# Altium schematic sheet 4.SchDoc
size 420 x 297 mm
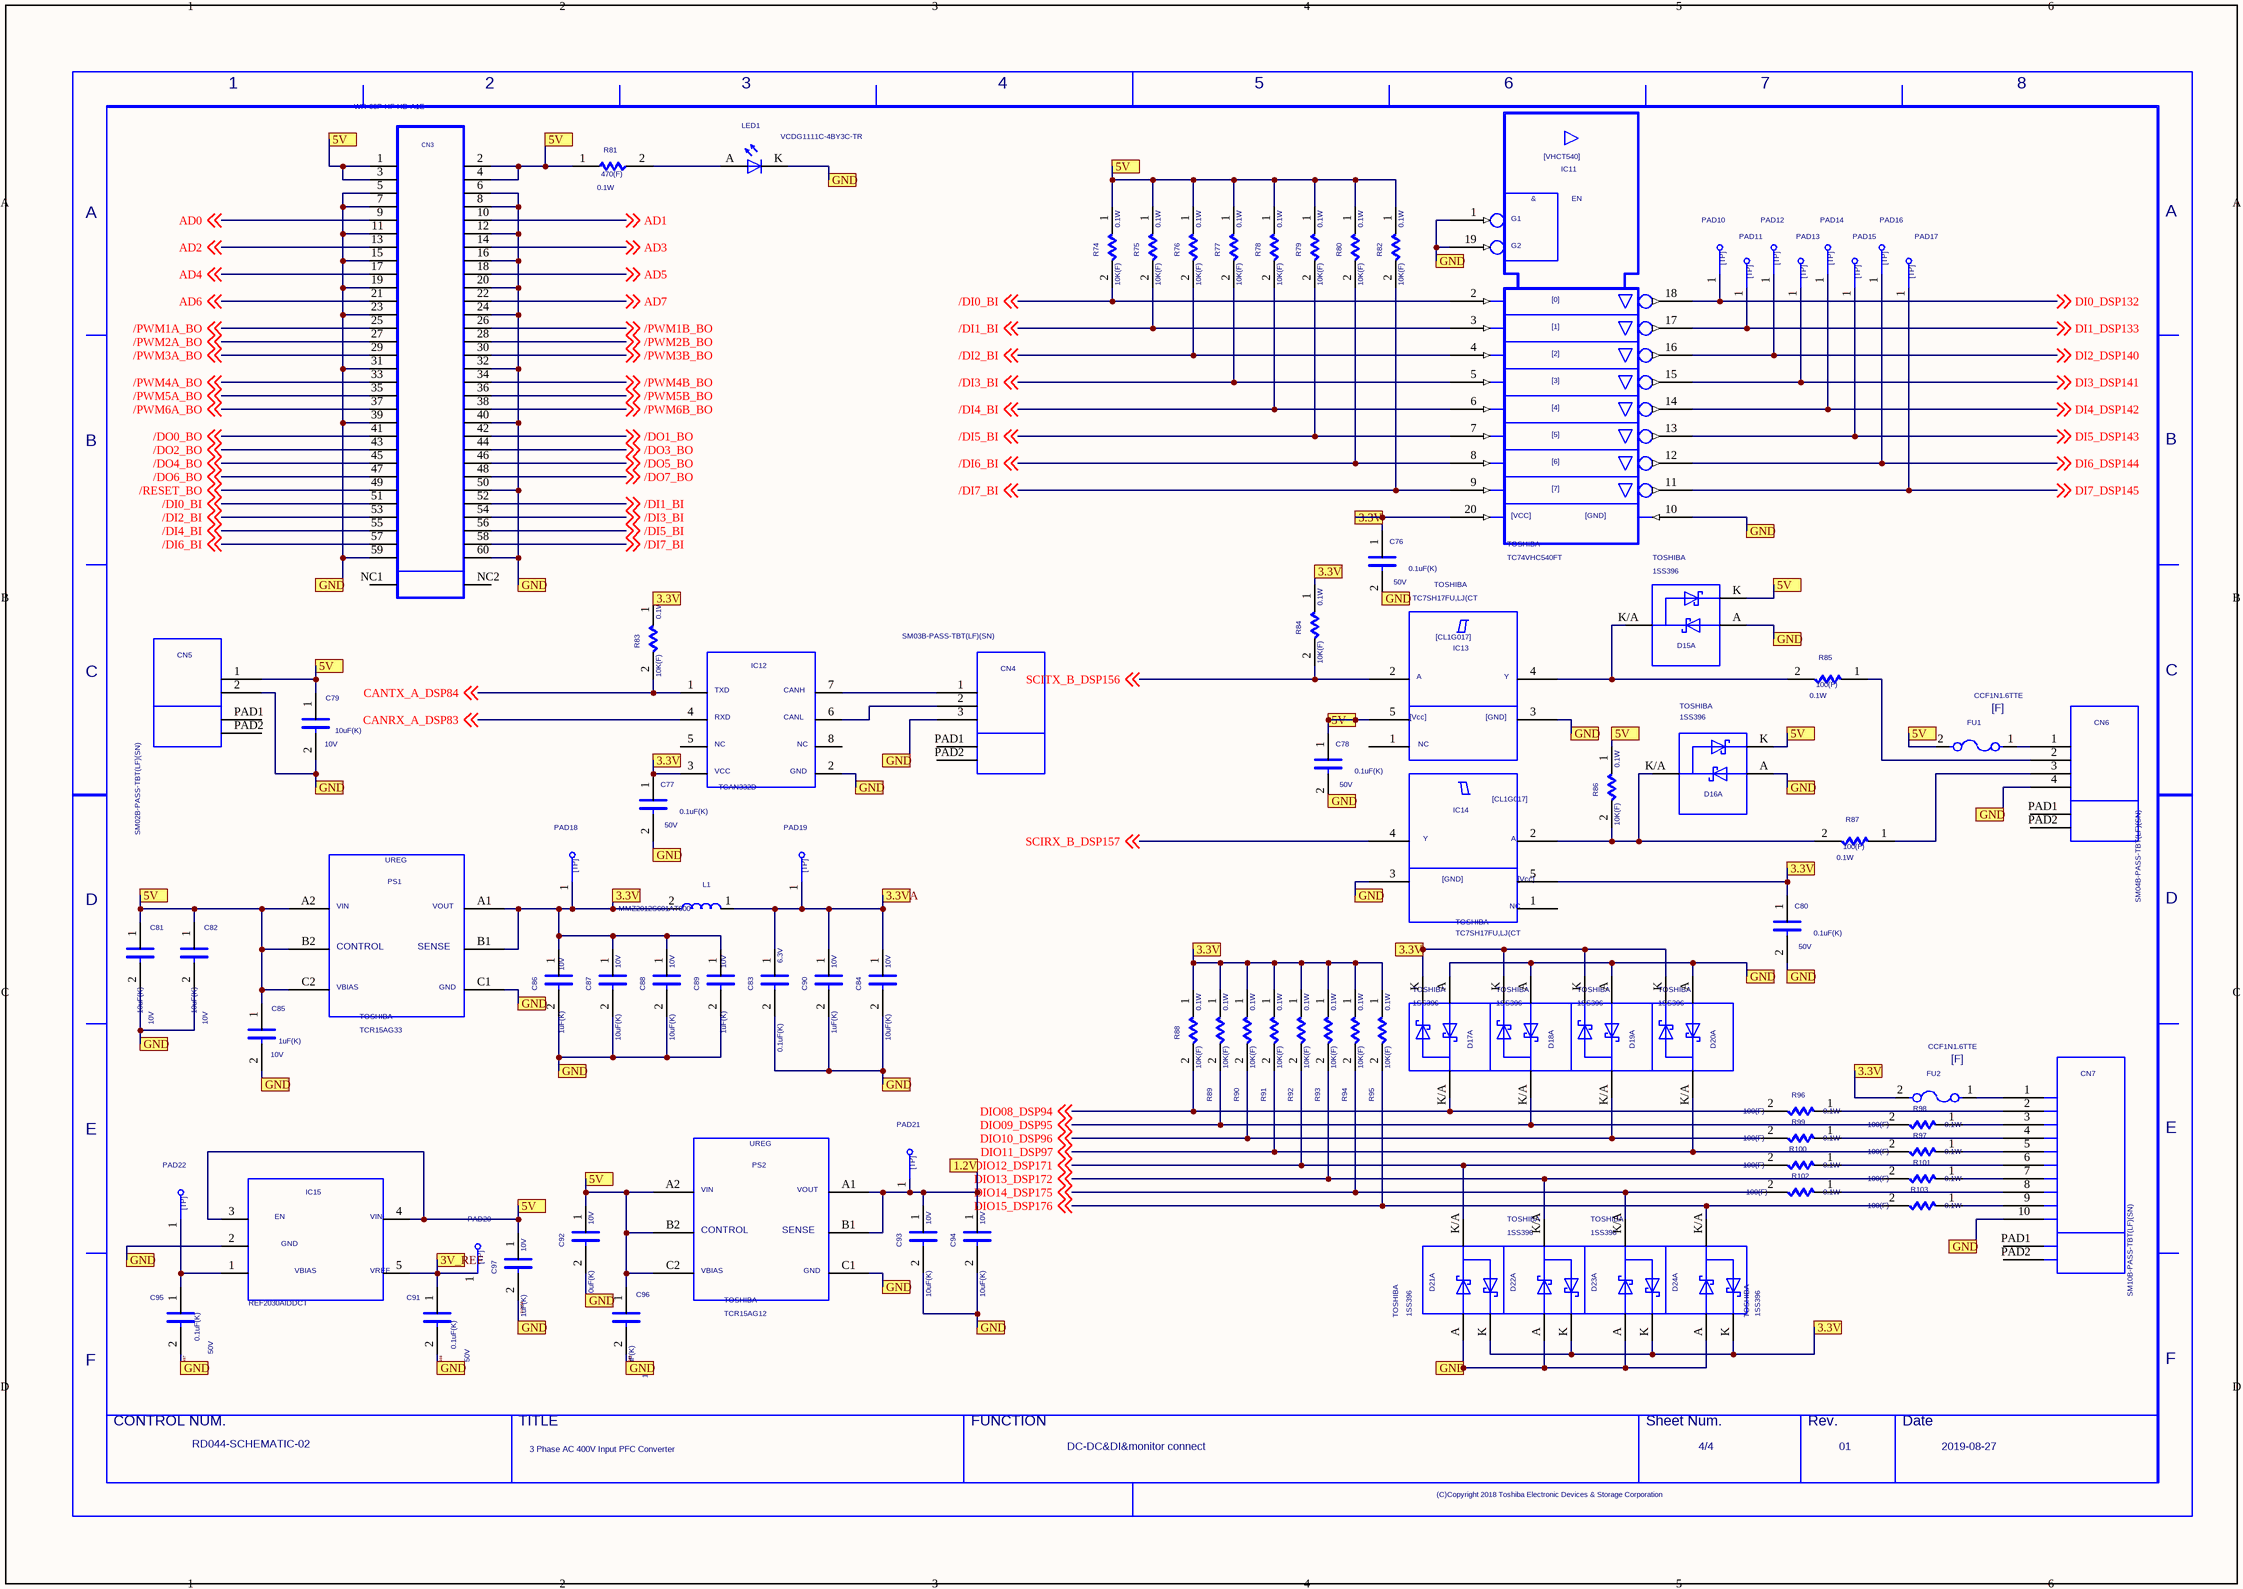
[diagram p0: 4.SchDoc]

## Parts
C76  VAL2: 50V  VAL1: 0.1uF(K)  (hidden comment: C)
C77  VAL2: 50V  VAL1: 0.1uF(K)  (hidden comment: C)
C78  VAL2: 50V  VAL1: 0.1uF(K)  (hidden comment: C)
C79  VAL2: 10V  VAL1: 10uF(K)  (hidden comment: C)
C80  VAL2: 50V  VAL1: 0.1uF(K)  (hidden comment: C)
C81  VAL2: 10V  VAL1: 10uF(K)  (hidden comment: C)
C82  VAL2: 10V  VAL1: 10uF(K)  (hidden comment: C)
C83  VAL2: 6.3V  VAL1: 0.1uF(K)  (hidden comment: C)
C84  VAL2: 10V  VAL1: 10uF(K)  (hidden comment: C)
C85  VAL2: 10V  VAL1: 1uF(K)  (hidden comment: C)
C86  VAL2: 10V  VAL1: 1uF(K)  (hidden comment: C)
C87  VAL2: 10V  VAL1: 10uF(K)  (hidden comment: C)
C88  VAL2: 10V  VAL1: 10uF(K)  (hidden comment: C)
C89  VAL2: 10V  VAL1: 1uF(K)  (hidden comment: C)
C90  VAL2: 10V  VAL1: 1uF(K)  (hidden comment: C)
C91  VAL2: 50V  VAL1: 0.1uF(K)  (hidden comment: C)
C92  VAL2: 10V  VAL1: 10uF(K)  (hidden comment: C)
C93  VAL2: 10V  VAL1: 10uF(K)  (hidden comment: C)
C94  VAL2: 10V  VAL1: 10uF(K)  (hidden comment: C)
C95  VAL2: 50V  VAL1: 0.1uF(K)  (hidden comment: C)
C96  VAL2: 10V  VAL1: 1uF(K)  (hidden comment: C)
C97  VAL2: 10V  VAL1: 1uF(K)  (hidden comment: C)
CN3  VAL3: WR-60P-HF-HD-A1E  (hidden comment: WR-60P)
CN4  VAL3: SM03B-PASS-TBT(LF)(SN)  (hidden comment: BM03B-PASS)
CN5  VAL3: SM02B-PASS-TBT(LF)(SN)  (hidden comment: BM02B-PASS)
CN6  VAL3: SM04B-PASS-TBT(LF)(SN)  (hidden comment: BM04B-PASS)
CN7  VAL3: SM10B-PASS-TBT(LF)(SN)  (hidden comment: SM10B-PASS)
D15  USERCOMPTEXT3: TOSHIBA  (hidden comment: 1SS396)  (part A of 3)
D16  USERCOMPTEXT3: TOSHIBA  (hidden comment: 1SS396)  (part A of 3)
D17  USERCOMPTEXT3: TOSHIBA  (hidden comment: 1SS396)  (part A of 3)
D18  USERCOMPTEXT3: TOSHIBA  (hidden comment: 1SS396)  (part A of 3)
D19  USERCOMPTEXT3: TOSHIBA  (hidden comment: 1SS396)  (part A of 3)
D20  USERCOMPTEXT3: TOSHIBA  (hidden comment: 1SS396)  (part A of 3)
D21  USERCOMPTEXT3: TOSHIBA  (hidden comment: 1SS396)  (part A of 3)
D22  USERCOMPTEXT3: TOSHIBA  (hidden comment: 1SS396)  (part A of 3)
D23  USERCOMPTEXT3: TOSHIBA  (hidden comment: 1SS396)  (part A of 3)
D24  USERCOMPTEXT3: TOSHIBA  (hidden comment: 1SS396)  (part A of 3)
FU1  VAL3: CCF1N1.6TTE  (hidden comment: F)
FU2  VAL3: CCF1N1.6TTE  (hidden comment: F)
IC11  USERCOMPTEXT3: TOSHIBA  VAL3: TC74VHC540FT  (hidden comment: VHC540)
IC12  TCAN332D
IC13  USERCOMPTEXT3: TOSHIBA  VAL3: TC7SH17FU,LJ(CT  (hidden comment: CL1G017)
IC14  USERCOMPTEXT3: TOSHIBA  VAL3: TC7SH17FU,LJ(CT  (hidden comment: CL1G017)
IC15  VAL3: REF2030AIDDCT  (hidden comment: REF)
L1  VAL3: MMZ2012S601AT000  (hidden comment: L)
LED1  VAL3: VCDG1111C-4BY3C-TR  (hidden comment: VCDG1111C)
PAD10  TP  (value not drawn)
PAD11  TP  (value not drawn)
PAD12  TP  (value not drawn)
PAD13  TP  (value not drawn)
PAD14  TP  (value not drawn)
PAD15  TP  (value not drawn)
PAD16  TP  (value not drawn)
PAD17  TP  (value not drawn)
PAD18  TP  (value not drawn)
PAD19  TP  (value not drawn)
PAD20  TP  (value not drawn)
PAD21  TP  (value not drawn)
PAD22  TP  (value not drawn)
PS1  USERCOMPTEXT3: TOSHIBA  VAL3: TCR15AG33  (hidden comment: L15AG)
PS2  USERCOMPTEXT3: TOSHIBA  VAL3: TCR15AG12  (hidden comment: L15AG)
R74  VAL2: 0.1W  VAL1: 10K(F)  (hidden comment: R)
R75  VAL2: 0.1W  VAL1: 10K(F)  (hidden comment: R)
R76  VAL2: 0.1W  VAL1: 10K(F)  (hidden comment: R)
R77  VAL2: 0.1W  VAL1: 10K(F)  (hidden comment: R)
R78  VAL2: 0.1W  VAL1: 10K(F)  (hidden comment: R)
R79  VAL2: 0.1W  VAL1: 10K(F)  (hidden comment: R)
R80  VAL2: 0.1W  VAL1: 10K(F)  (hidden comment: R)
R81  VAL2: 0.1W  VAL1: 470(F)  (hidden comment: R)
R82  VAL2: 0.1W  VAL1: 10K(F)  (hidden comment: R)
R83  VAL2: 0.1W  VAL1: 10K(F)  (hidden comment: R)
R84  VAL2: 0.1W  VAL1: 10K(F)  (hidden comment: R)
R85  VAL2: 0.1W  VAL1: 100(F)  (hidden comment: R)
R86  VAL2: 0.1W  VAL1: 10K(F)  (hidden comment: R)
R87  VAL2: 0.1W  VAL1: 100(F)  (hidden comment: R)
R88  VAL2: 0.1W  VAL1: 10K(F)  (hidden comment: R)
R89  VAL2: 0.1W  VAL1: 10K(F)  (hidden comment: R)
R90  VAL2: 0.1W  VAL1: 10K(F)  (hidden comment: R)
R91  VAL2: 0.1W  VAL1: 10K(F)  (hidden comment: R)
R92  VAL2: 0.1W  VAL1: 10K(F)  (hidden comment: R)
R93  VAL2: 0.1W  VAL1: 10K(F)  (hidden comment: R)
R94  VAL2: 0.1W  VAL1: 10K(F)  (hidden comment: R)
R95  VAL2: 0.1W  VAL1: 10K(F)  (hidden comment: R)
R96  VAL2: 0.1W  VAL1: 100(F)  (hidden comment: R)
R97  VAL2: 0.1W  VAL1: 100(F)  (hidden comment: R)
R98  VAL2: 0.1W  VAL1: 100(F)  (hidden comment: R)
R99  VAL2: 0.1W  VAL1: 100(F)  (hidden comment: R)
R100  VAL2: 0.1W  VAL1: 100(F)  (hidden comment: R)
R101  VAL2: 0.1W  VAL1: 100(F)  (hidden comment: R)
R102  VAL2: 0.1W  VAL1: 100(F)  (hidden comment: R)
R103  VAL2: 0.1W  VAL1: 100(F)  (hidden comment: R)
U?  DATE: 2019-08-27  REVISION: 01  SHEETNUMBER: 4/4  FUNCTION: DC-DC&DI&monitor connect  TITLE: 3 Phase AC 400V Input PFC Converter  DRAWINGNUMBER: RD044-SCHEMATIC-02  (hidden comment: WAKU_DEF100_2018)

## Ports
1.2V, 3.3V, 3.3VA, 3V_REF, 5V, GND

## Nets
1.2V: C93.1 C94.1 PAD21.1 PS2.A1 PS2.B1 ; port 1.2V
3.3V: C76.1 C77.1 C80.1 C86.1 C87.1 C88.1 C89.1 D17.K D18.K D19.K D20.K D21.K D22.K D23.K D24.K FU2.2 IC11.20 IC12.3 IC14.5 L1.2 PAD18.1 PS1.A1 PS1.B1 R83.1 R84.1 R88.1 R89.1 R90.1 R91.1 R92.1 R93.1 R94.1 R95.1 ; port 3.3V
3.3VA: C83.1 C84.1 C90.1 L1.1 PAD19.1 ; port 3.3VA
3V_REF: C91.1 IC15.5 PAD20.1 ; port 3V_REF
5V: C78.1 C79.1 C81.1 C82.1 C85.1 C92.1 C96.1 C97.1 CN3.1 CN3.2 CN3.3 CN3.4 CN5.1 D15.K D16.K FU1.2 IC13.5 IC15.3 IC15.4 PS1.A2 PS1.B2 PS1.C2 PS2.A2 PS2.B2 PS2.C2 R74.1 R75.1 R76.1 R77.1 R78.1 R79.1 R80.1 R81.1 R82.1 R86.1 ; port 5V
/DI0_BI: CN3.51 IC11.2 R74.2 ; off-sheet /DI0_BI
/DI1_BI: CN3.52 IC11.3 R75.2 ; off-sheet /DI1_BI
/DI2_BI: CN3.53 IC11.4 R76.2 ; off-sheet /DI2_BI
/DI3_BI: CN3.54 IC11.5 R77.2 ; off-sheet /DI3_BI
/DI4_BI: CN3.55 IC11.6 R78.2 ; off-sheet /DI4_BI
/DI5_BI: CN3.56 IC11.7 R79.2 ; off-sheet /DI5_BI
/DI6_BI: CN3.57 IC11.8 R80.2 ; off-sheet /DI6_BI
/DI7_BI: CN3.58 IC11.9 R82.2 ; off-sheet /DI7_BI
/DO0_BO: CN3.41 ; off-sheet /DO0_BO
/DO1_BO: CN3.42 ; off-sheet /DO1_BO
/DO2_BO: CN3.43 ; off-sheet /DO2_BO
/DO3_BO: CN3.44 ; off-sheet /DO3_BO
/DO4_BO: CN3.45 ; off-sheet /DO4_BO
/DO5_BO: CN3.46 ; off-sheet /DO5_BO
/DO6_BO: CN3.47 ; off-sheet /DO6_BO
/DO7_BO: CN3.48 ; off-sheet /DO7_BO
/PWM1A_BO: CN3.25 ; off-sheet /PWM1A_BO
/PWM1B_BO: CN3.26 ; off-sheet /PWM1B_BO
/PWM2A_BO: CN3.27 ; off-sheet /PWM2A_BO
/PWM2B_BO: CN3.28 ; off-sheet /PWM2B_BO
/PWM3A_BO: CN3.29 ; off-sheet /PWM3A_BO
/PWM3B_BO: CN3.30 ; off-sheet /PWM3B_BO
/PWM4A_BO: CN3.33 ; off-sheet /PWM4A_BO
/PWM4B_BO: CN3.34 ; off-sheet /PWM4B_BO
/PWM5A_BO: CN3.35 ; off-sheet /PWM5A_BO
/PWM5B_BO: CN3.36 ; off-sheet /PWM5B_BO
/PWM6A_BO: CN3.37 ; off-sheet /PWM6A_BO
/PWM6B_BO: CN3.38 ; off-sheet /PWM6B_BO
/RESET_BO: CN3.49 ; off-sheet /RESET_BO
AD0: CN3.9 ; off-sheet AD0
AD1: CN3.10 ; off-sheet AD1
AD2: CN3.13 ; off-sheet AD2
AD3: CN3.14 ; off-sheet AD3
AD4: CN3.17 ; off-sheet AD4
AD5: CN3.18 ; off-sheet AD5
AD6: CN3.21 ; off-sheet AD6
AD7: CN3.22 ; off-sheet AD7
CANRX_A_DSP83: IC12.4 ; off-sheet CANRX_A_DSP83
CANTX_A_DSP84: IC12.1 R83.2 ; off-sheet CANTX_A_DSP84
DI0_DSP132: IC11.18 PAD10.1 ; off-sheet DI0_DSP132
DI1_DSP133: IC11.17 PAD11.1 ; off-sheet DI1_DSP133
DI2_DSP140: IC11.16 PAD12.1 ; off-sheet DI2_DSP140
DI3_DSP141: IC11.15 PAD13.1 ; off-sheet DI3_DSP141
DI4_DSP142: IC11.14 PAD14.1 ; off-sheet DI4_DSP142
DI5_DSP143: IC11.13 PAD15.1 ; off-sheet DI5_DSP143
DI6_DSP144: IC11.12 PAD16.1 ; off-sheet DI6_DSP144
DI7_DSP145: IC11.11 PAD17.1 ; off-sheet DI7_DSP145
DIO08_DSP94: D17.K/A R88.2 R96.2 ; off-sheet DIO08_DSP94
DIO09_DSP95: D18.K/A R89.2 R98.2 ; off-sheet DIO09_DSP95
DIO10_DSP96: D19.K/A R90.2 R99.2 ; off-sheet DIO10_DSP96
DIO11_DSP97: D20.K/A R91.2 R97.2 ; off-sheet DIO11_DSP97
DIO12_DSP171: D21.K/A R92.2 R100.2 ; off-sheet DIO12_DSP171
DIO13_DSP172: D22.K/A R93.2 R101.2 ; off-sheet DIO13_DSP172
DIO14_DSP175: D23.K/A R94.2 R102.2 ; off-sheet DIO14_DSP175
DIO15_DSP176: D24.K/A R95.2 R103.2 ; off-sheet DIO15_DSP176
N16642513: C95.1 IC15.1 PAD22.1
N16664780: D15.K/A IC13.4 R85.2
N16668564: D16.K/A IC14.2 R86.2 R87.2
N16668568: CN6.3 R87.1
N16669496: CN4.1 IC12.7
N16669500: CN4.2 IC12.6
N16671270: CN6.2 R85.1
N16690596: LED1.A R81.2
N16817849: CN7.9 R103.1
N16817854: CN7.8 R102.1
N16817859: CN7.7 R101.1
N16817864: CN7.6 R100.1
N16817869: CN7.5 R97.1
N16817874: CN7.4 R99.1
N16817879: CN7.3 R98.1
N16817884: CN7.2 R96.1
N16840741: CN7.1 FU2.1
N16841842: CN6.1 FU1.1
SCIRX_B_DSP157: IC14.4 ; off-sheet SCIRX_B_DSP157
SCITX_B_DSP156: IC13.2 R84.2 ; off-sheet SCITX_B_DSP156
SIG466: C76.2 C77.2 C78.2 C79.2 C80.2 C81.2 C82.2 C83.2 C84.2 C85.2 C86.2 C87.2 C88.2 C89.2 C90.2 C91.2 C92.2 C93.2 C94.2 C95.2 C96.2 C97.2 CN3.5 CN3.6 CN3.7 CN3.8 CN3.11 CN3.12 CN3.15 CN3.16 CN3.19 CN3.20 CN3.23 CN3.24 CN3.31 CN3.32 CN3.39 CN3.40 CN3.50 CN3.59 CN3.60 CN4.3 CN5.2 CN6.4 CN7.10 D15.A D16.A D17.A D18.A D19.A D20.A D21.A D22.A D23.A D24.A IC11.1 IC11.10 IC11.19 IC12.2 IC13.3 IC14.3 IC15.2 LED1.K PS1.C1 PS2.C1 ; port GND  [also labelled SIG467, SIG468, SIG469]

Not connected (* = marked no-connect by the designer): CN3 NC1 NC2; CN4 PAD1 PAD2; CN5 PAD1 PAD2; CN6 PAD1 PAD2; CN7 PAD1 PAD2; IC12 5 8; IC13 1; IC14 1

## Notes on the sheet
- (in symbol CL1G017) [CL1G017]; A; Y; [Vcc]; [GND]; NC
- (in symbol F) [F]
- (in symbol L15AG) UREG; VIN; VOUT; CONTROL; SENSE; VBIAS; GND
- (in symbol REF) EN; VIN; GND; VBIAS; VREF
- (in symbol TCAN332D) TXD; CANH; RXD; CANL; NC; VCC; GND
- (in symbol TP) [TP]
- (in symbol VHC540) [VHCT540]; &; EN; G1; G2; [0]; [1]; [2]; [3]; [4]; [5]; [6]; [7]; [VCC]; [GND]
- (in symbol WAKU_DEF100_2018) 1; 3; 5; 6; 7; 8; A; B; C; D; E; F; CONTROL NUM.; TITLE; FUNCTION; Sheet Num.; Rev.; Date; (C)Copyright 2018 Toshiba Electronic Devices & Storage Corporation

## Library data of the parts
C76-C78 C80 C91 C95 = C: PARTNAME: C-GRM188R71H104KA93D; OriginalSymbolOrigin: (2540,7620); USERCOMPTEXT1: 1608; COMPONENTTYPE: 4; COMPONENTKIND: 108
C79 C81 C82 C84 C87 C88 C92-C94 = C: PARTNAME: C-GRM188R61A106KE69D; OriginalSymbolOrigin: (2540,7620); USERCOMPTEXT1: 1608; COMPONENTTYPE: 4; COMPONENTKIND: 108
C83 = C: PARTNAME: C-GRM155R70J104KA01D; OriginalSymbolOrigin: (2540,7620); USERCOMPTEXT1: 1005; COMPONENTTYPE: 4; COMPONENTKIND: 108
C85 C86 C89 C90 C96 C97 = C: PARTNAME: C-GRM188R71A105KA61D; OriginalSymbolOrigin: (2540,7620); USERCOMPTEXT1: 1608; COMPONENTTYPE: 4; COMPONENTKIND: 108
CN3 = WR-60P: PARTNAME: CN-WR-60P-HF-HD-A1E; SAVEAREA0: -67682,-998,88845,96631; SAVECOUNT: 3; TIME: 09:42:27; UPDATEUSER: cae; UPDATETIME: 10:25:54; OriginalSymbolOrigin: (5080,91440); COMPONENTTYPE: 4; COMPONENTKIND: 111; AUTHOR: cae; DATE: 2019/07/05; UPDATEDATE: 2019/08/02
CN4 = BM03B-PASS: PARTNAME: CN-SM03B-PASS-TBT_LF_SN; SAVEAREA0: -16737,-296,39143,28727; SAVECOUNT: 24; TIME: 13:28:28; UPDATEUSER: cae; UPDATETIME: 10:14:21; OriginalSymbolOrigin: (2540,25400); COMPONENTTYPE: 4; COMPONENTKIND: 135; AUTHOR: user1; DATE: 2004/01/19; UPDATEDATE: 2019/06/25
CN5 = BM02B-PASS: PARTNAME: CN-SM02B-PASS-TBT_LF_SN; SAVEAREA0: -14164,-269,36638,26116; SAVECOUNT: 26; TIME: 13:28:28; UPDATEUSER: cae; UPDATETIME: 10:15:00; OriginalSymbolOrigin: (2540,22860); COMPONENTTYPE: 4; COMPONENTKIND: 135; AUTHOR: user1; DATE: 2004/01/19; UPDATEDATE: 2019/06/25
CN6 = BM04B-PASS: PARTNAME: CN-SM04B-PASS-TBT_LF_SN; SAVEAREA0: -19295,-323,41666,31339; SAVECOUNT: 22; TIME: 13:28:28; UPDATEUSER: cae; UPDATETIME: 10:17:11; OriginalSymbolOrigin: (2540,27940); COMPONENTTYPE: 4; COMPONENTKIND: 135; AUTHOR: user1; DATE: 2004/01/19; UPDATEDATE: 2019/06/25
CN7 = SM10B-PASS: PARTNAME: CN-SM10B-PASS-TBT_LF_SN; SAVEAREA0: -33411,-485,58033,47009; SAVECOUNT: 23; TIME: 13:28:28; UPDATEUSER: cae; UPDATETIME: 14:27:01; OriginalSymbolOrigin: (2540,43180); COMPONENTTYPE: 4; COMPONENTKIND: 135; AUTHOR: user1; DATE: 2004/01/19; UPDATEDATE: 2019/07/22
D15-D24 = 1SS396: PARTNAME: D-1SS396_AK; SAVECOUNT: 7; SAVEAREA0: -5465,-437,27678,21425; TIME: 18:51:12; UPDATEUSER: cae; UPDATETIME: 10:39:29; OriginalSymbolOrigin: (5080,17780); COMPONENTTYPE: 4; COMPONENTKIND: 103; AUTHOR: sato-yr; DATE: 2002/11/26; UPDATEDATE: 2019/08/02; VAL3: 1SS396
FU1 FU2 = F: PARTNAME: FU-CCF1N1.6TTE; OriginalSymbolOrigin: (2540,5080); COMPONENTTYPE: 4; COMPONENTKIND: 119
IC11 = VHC540: PARTNAME: IC-TC74VHC540FT; SAVEAREA0: -64373,-927,110287,89788; TIME: 09:37:32; UPDATEUSER: cae; SAVECOUNT: 1; OriginalSymbolOrigin: (7620,83820); COMPONENTTYPE: 4; COMPONENTKIND: 101; AUTHOR: cae; DATE: 2019/07/12; UPDATEDATE: 2019/07/12; UPDATETIME: 09:37:32
IC12 = TCAN332D: PARTNAME: IC-TCAN332D; SAVECOUNT: 26; SAVEAREA0: -15475,-323,45487,31339; TIME: 17:47:02; UPDATEUSER: cae; UPDATETIME: 14:38:54; OriginalSymbolOrigin: (5080,27940); COMPONENTTYPE: 4; COMPONENTKIND: 101; AUTHOR: omeh0432; DATE: 2003/04/15; UPDATEDATE: 2019/07/22; VAL3: TCAN332D
IC13 IC14 = CL1G017: PARTNAME: IC-TC7SH17F; OUMEPARTTYPE: IC; TIME: 16:09:43; UPDATEUSER: tomizawa-y; UPDATETIME: 12:13:51; SAVECOUNT: 12; SAVEAREA0: -8892,-376,44463,33313; OriginalSymbolOrigin: (7620,30480); MAXGCOUNT: 1; OUMEMAKER: TSB 東芝; MOUNTINGFORMSMD: SMD; FNLEADFREETHET1GT2GMCTH1: 2_0_N; OUMECLASSIFICATION: CMOSロジック; PMPRODUCTSTYPEG: PC1; ADSCNVFLAG: ON; PROCESS: 74VHC; CDMASTERCADCELG: DIC8C8; COMPONENTTYPE: 4; COMPONENTKIND: 101; AUTHOR: e2117910; DATE: 2003/02/06; UPDATEDATE: 2004/03/26; GCOUNT: 1; OUMEMAKERKATAMEI: TC7SH17FU,LJ(CT; VAL1: TC7SH17FU,LJ(CT
IC15 = REF: PARTNAME: IC-REF2030AIDDCT; SAVECOUNT: 25; SAVEAREA0: -10386,-296,45494,28727; TIME: 17:47:02; UPDATEUSER: cae; UPDATETIME: 11:05:59; OriginalSymbolOrigin: (5080,25400); COMPONENTTYPE: 4; COMPONENTKIND: 101; AUTHOR: omeh0432; DATE: 2003/04/15; UPDATEDATE: 2019/06/25
L1 = L: PARTNAME: L-MMZ2012S601AT000; OriginalSymbolOrigin: (2540,5080); COMPONENTTYPE: 4; COMPONENTKIND: 117
LED1 = VCDG1111C: PARTNAME: LED-VCDG1111C-4BY3C-TR; SAVEAREA0: -6769,-859,19276,16321; TIME: 14:49:55; UPDATEUSER: cae; UPDATETIME: 10:51:12; SAVECOUNT: 5; OriginalSymbolOrigin: (5080,7620); COMPONENTTYPE: 4; COMPONENTKIND: 104; AUTHOR: ikeda-k; DATE: 2003/02/07; UPDATEDATE: 2019/08/02
PAD10 PAD18-PAD22 = TP: PARTNAME: TP-PAD1.0; TIME: 16:12:21; UPDATEUSER: fukuda-y; UPDATETIME: 16:18:11; SAVECOUNT: 2; SAVEAREA0: -242,-92,12810,7836; OriginalSymbolOrigin: (0,7620); VAL3: TP_PAD; COMPONENTTYPE: 4; COMPONENTKIND: 128; AUTHOR: fukuda-y; DATE: 2006/10/04; UPDATEDATE: 2006/10/04
PAD11-PAD17 = TP: PARTNAME: TP-PAD1.0; TIME: 16:12:21; UPDATEUSER: fukuda-y; UPDATETIME: 16:18:11; SAVECOUNT: 2; SAVEAREA0: -242,-92,12810,7836; OriginalSymbolOrigin: (0,7620); COMPONENTTYPE: 4; COMPONENTKIND: 128; AUTHOR: fukuda-y; DATE: 2006/10/04; UPDATEDATE: 2006/10/04
PS1 = L15AG: PARTNAME: PS-TCR15AG33; TIME: 08:44:39; UPDATEUSER: cae; UPDATETIME: 13:17:54; SAVECOUNT: 102; SAVEAREA0: -14581,-371,55282,35914; OriginalSymbolOrigin: (7620,33020); COMPONENTTYPE: 4; COMPONENTKIND: 101; AUTHOR: utauser; DATE: 2002/12/27; UPDATEDATE: 2019/07/22
PS2 = L15AG: PARTNAME: PS-TCR15AG12; TIME: 08:44:39; UPDATEUSER: cae; UPDATETIME: 13:17:54; SAVECOUNT: 102; SAVEAREA0: -14581,-371,55282,35914; OriginalSymbolOrigin: (7620,33020); COMPONENTTYPE: 4; COMPONENTKIND: 101; AUTHOR: utauser; DATE: 2002/12/27; UPDATEDATE: 2019/07/22
R74-R80 R82-R84 R86 R88-R95 = R: PARTNAME: R-ERJ3EKF1002V; OriginalSymbolOrigin: (5080,5080); USERCOMPTEXT1: 1608; COMPONENTTYPE: 4; COMPONENTKIND: 105
R81 = R: PARTNAME: R-ERJ3EKF4700V; OriginalSymbolOrigin: (5080,5080); USERCOMPTEXT1: 1608; COMPONENTTYPE: 4; COMPONENTKIND: 105
R85 R87 R96-R103 = R: PARTNAME: R-ERJ3EKF1000V; OriginalSymbolOrigin: (5080,5080); USERCOMPTEXT1: 1608; COMPONENTTYPE: 4; COMPONENTKIND: 105
U? = WAKU_DEF100_2018: PLOTTIME: HH:MM; SAVEAREA0: -45080,-4508,463680,304612; TIME: 13:54:34; UPDATEUSER: t5459927; UPDATETIME: 12:04:35; SAVECOUNT: 4; OriginalSymbolOrigin: (10160,284480); COMPONENTTYPE: 2; COMPONENTKIND: 0; PLOTDATE: YYYY.MM.DD; AUTHOR: cae; UPDATEDATE: 2019/08/29